# EAGLE design DataBreak (EAGLE 6.6.0)
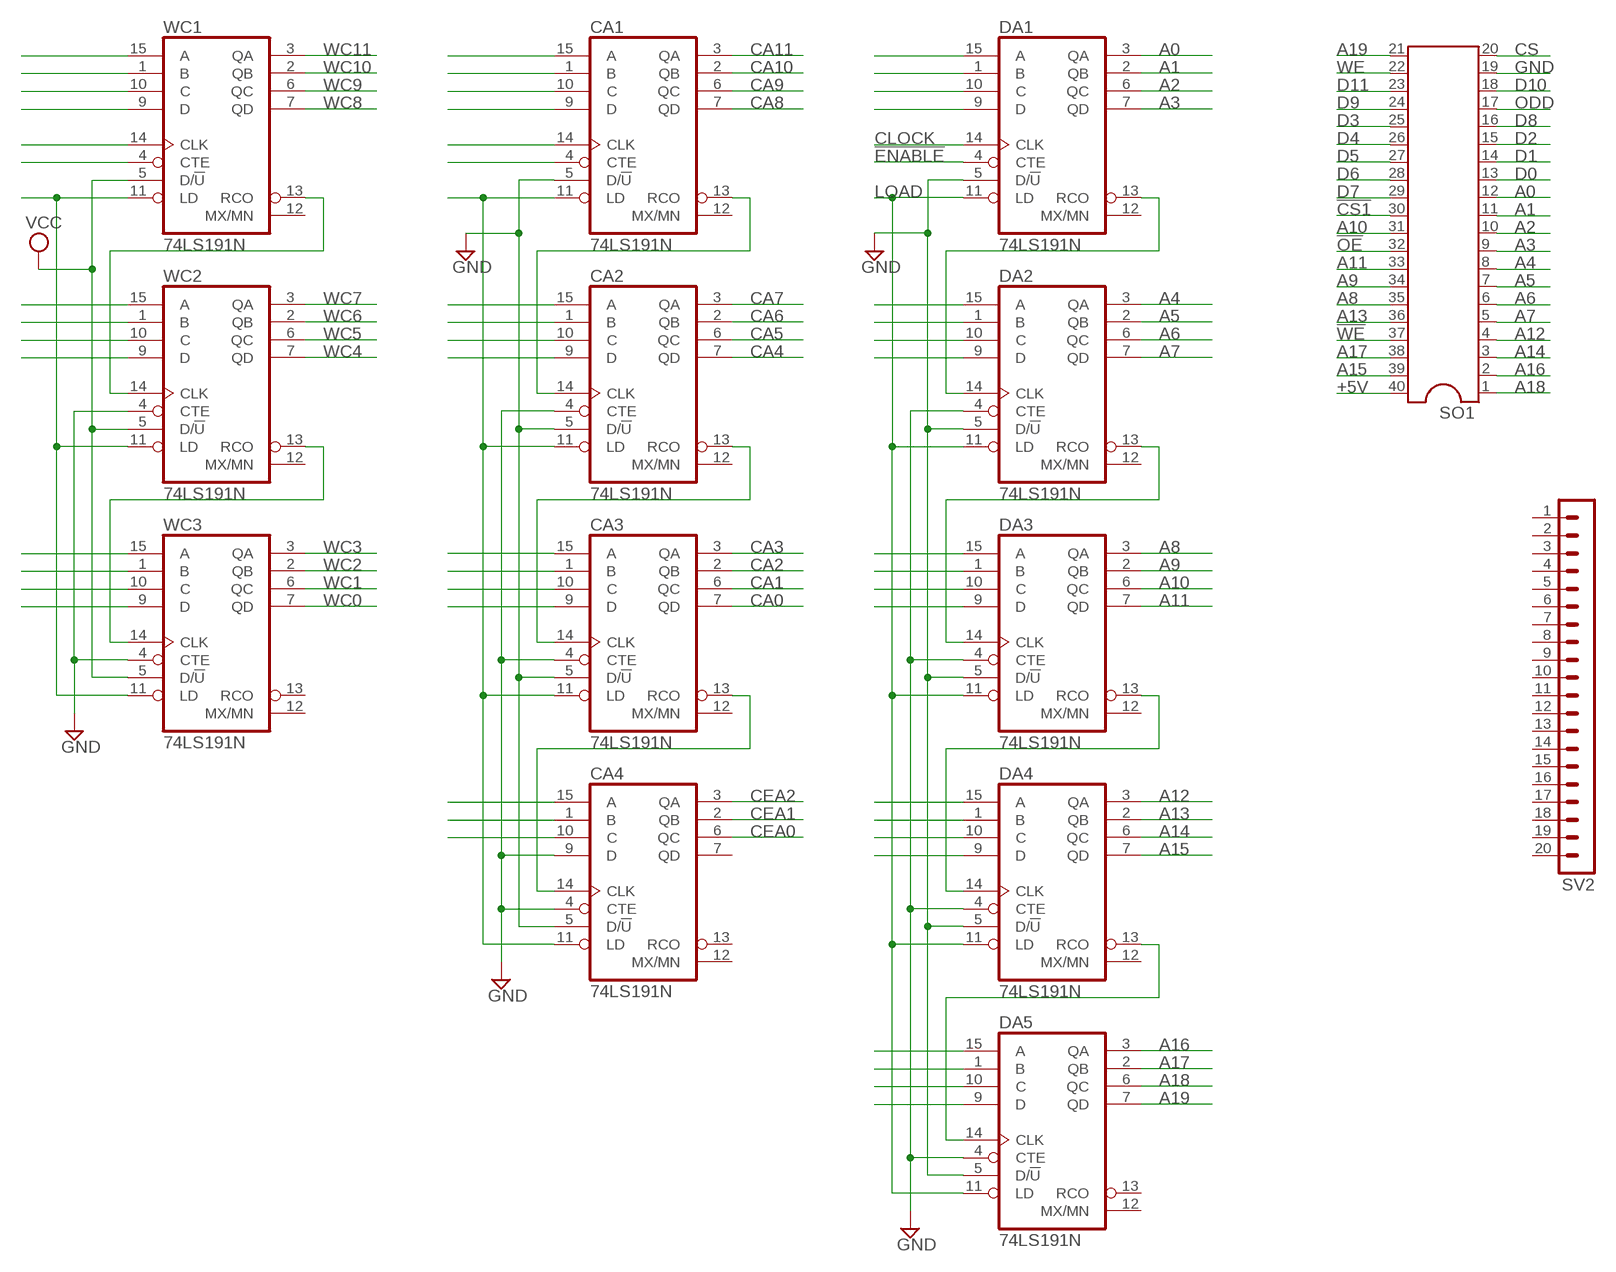
[diagram p0: schematic, sheet 1]

## Parts
CA1  74LS191N  74LS190N  [DIL16]
CA2  74LS191N  74LS190N  [DIL16]
CA3  74LS191N  74LS190N  [DIL16]
CA4  74LS191N  74LS190N  [DIL16]
DA1  74LS191N  74LS190N  [DIL16]
DA2  74LS191N  74LS190N  [DIL16]
DA3  74LS191N  74LS190N  [DIL16]
DA4  74LS191N  74LS190N  [DIL16]
DA5  74LS191N  74LS190N  [DIL16]
SO1  DIL40  [DIL40]
SV2  MA20-1L  [MA20-1L]
WC1  74LS191N  74LS190N  [DIL16]
WC2  74LS191N  74LS190N  [DIL16]
WC3  74LS191N  74LS190N  [DIL16]

## Nets
!CS1: SO1.30
!ENABLE: DA1.4(CTE)
!OE: SO1.32
!WE: SO1.37
+5V: SO1.40
A0: DA1.3(QA) SO1.12
A1: DA1.2(QB) SO1.11
A2: DA1.6(QC) SO1.10
A3: DA1.7(QD) SO1.9
A4: DA2.3(QA) SO1.8
A5: DA2.2(QB) SO1.7
A6: DA2.6(QC) SO1.6
A7: DA2.7(QD) SO1.5
A8: DA3.3(QA) SO1.35
A9: DA3.2(QB) SO1.34
A10: DA3.6(QC) SO1.31
A11: DA3.7(QD) SO1.33
A12: DA4.3(QA) SO1.4
A13: DA4.2(QB) SO1.36
A14: DA4.6(QC) SO1.3
A15: DA4.7(QD) SO1.39
A16: DA5.3(QA) SO1.2
A17: DA5.2(QB) SO1.38
A18: DA5.6(QC) SO1.1
A19: DA5.7(QD) SO1.21
CA0: CA3.7(QD)
CA1: CA3.6(QC)
CA2: CA3.2(QB)
CA3: CA3.3(QA)
CA4: CA2.7(QD)
CA5: CA2.6(QC)
CA6: CA2.2(QB)
CA7: CA2.3(QA)
CA8: CA1.7(QD)
CA9: CA1.6(QC)
CA10: CA1.2(QB)
CA11: CA1.3(QA)
CEA0: CA4.6(QC)
CEA1: CA4.2(QB)
CEA2: CA4.3(QA)
CLOCK: DA1.14(CLK)
CS: SO1.20
D0: SO1.13
D1: SO1.14
D2: SO1.15
D3: SO1.25
D4: SO1.26
D5: SO1.27
D6: SO1.28
D7: SO1.29
D8: SO1.16
D9: SO1.24
D10: SO1.18
D11: SO1.23
GND: CA1.5(D/!U) CA2.4(CTE) CA2.5(D/!U) CA3.4(CTE) CA3.5(D/!U) CA4.4(CTE) CA4.5(D/!U) CA4.9(D) DA1.5(D/!U) DA2.4(CTE) DA2.5(D/!U) DA3.4(CTE) DA3.5(D/!U) DA4.4(CTE) DA4.5(D/!U) DA5.4(CTE) DA5.5(D/!U) SO1.19 WC2.4(CTE) WC3.4(CTE)
LOAD: DA1.11(LD) DA2.11(LD) DA3.11(LD) DA4.11(LD) DA5.11(LD)
N$1: DA1.13(RCO) DA2.14(CLK)
N$2: DA1.15(A)
N$3: DA1.1(B)
N$4: DA1.10(C)
N$5: DA1.9(D)
N$6: DA2.15(A)
N$7: DA2.1(B)
N$8: DA2.10(C)
N$9: DA2.9(D)
N$10: DA2.13(RCO) DA3.14(CLK)
N$11: DA3.13(RCO) DA4.14(CLK)
N$12: DA4.13(RCO) DA5.14(CLK)
N$13: DA3.15(A)
N$14: DA3.1(B)
N$15: DA3.10(C)
N$16: DA3.9(D)
N$17: DA4.15(A)
N$18: CA1.15(A)
N$19: DA4.1(B)
N$20: DA4.9(D)
N$21: DA4.10(C)
N$22: DA5.15(A)
N$23: DA5.1(B)
N$24: DA5.10(C)
N$25: DA5.9(D)
N$26: WC1.13(RCO) WC2.14(CLK)
N$27: WC2.13(RCO) WC3.14(CLK)
N$28: CA1.13(RCO) CA2.14(CLK)
N$29: CA2.13(RCO) CA3.14(CLK)
N$30: CA3.13(RCO) CA4.14(CLK)
N$31: CA1.1(B)
N$32: CA1.14(CLK)
N$33: CA1.4(CTE)
N$34: CA1.10(C)
N$35: CA1.9(D)
N$36: CA2.1(B)
N$37: CA2.15(A)
N$38: CA2.9(D)
N$39: CA3.1(B)
N$40: CA3.10(C)
N$41: CA3.9(D)
N$42: CA4.15(A)
N$43: CA4.1(B)
N$44: CA4.10(C)
N$45: CA1.11(LD) CA2.11(LD) CA3.11(LD) CA4.11(LD)
N$46: WC1.11(LD) WC2.11(LD) WC3.11(LD)
N$47: WC1.15(A)
N$48: CA3.15(A)
N$49: CA2.10(C)
N$50: WC1.4(CTE)
N$51: WC1.14(CLK)
N$52: WC1.9(D)
N$53: WC1.1(B)
N$54: WC1.10(C)
N$55: WC2.15(A)
N$56: WC2.1(B)
N$57: WC2.10(C)
N$58: WC3.1(B)
N$59: WC3.15(A)
N$60: WC2.9(D)
N$61: WC3.10(C)
N$62: WC3.9(D)
ODD: SO1.17
VCC: WC1.5(D/!U) WC2.5(D/!U) WC3.5(D/!U)
WC0: WC3.7(QD)
WC1: WC3.6(QC)
WC2: WC3.2(QB)
WC3: WC3.3(QA)
WC4: WC2.7(QD)
WC5: WC2.6(QC)
WC6: WC2.2(QB)
WC7: WC2.3(QA)
WC8: WC1.7(QD)
WC9: WC1.6(QC)
WC10: WC1.2(QB)
WC11: WC1.3(QA)
WE: SO1.22
Unconnected: CA1.12(MX/MN) CA2.12(MX/MN) CA3.12(MX/MN) CA4.7(QD) CA4.12(MX/MN) CA4.13(RCO) DA1.12(MX/MN) DA2.12(MX/MN) DA3.12(MX/MN) DA4.12(MX/MN) DA5.12(MX/MN) DA5.13(RCO) SV2.1 SV2.2 SV2.3 SV2.4 SV2.5 SV2.6 SV2.7 SV2.8 SV2.9 SV2.10 SV2.11 SV2.12 SV2.13 SV2.14 SV2.15 SV2.16 SV2.17 SV2.18 SV2.19 SV2.20 WC1.12(MX/MN) WC2.12(MX/MN) WC3.12(MX/MN) WC3.13(RCO)

## Power pins joined to a net without a drawn wire
GND: CA1.8(GND) CA2.8(GND) CA3.8(GND) CA4.8(GND) DA1.8(GND) DA2.8(GND) DA3.8(GND) DA4.8(GND) DA5.8(GND) WC1.8(GND) WC2.8(GND) WC3.8(GND)
VCC: CA1.16(VCC) CA2.16(VCC) CA3.16(VCC) CA4.16(VCC) DA1.16(VCC) DA2.16(VCC) DA3.16(VCC) DA4.16(VCC) DA5.16(VCC) WC1.16(VCC) WC2.16(VCC) WC3.16(VCC)

## Library data of the parts
CA1-CA4 DA1-DA5 WC1-WC3 = 74xx-us:74*190: Synchronous UP/DOWN COUNTER
SO1 = ic-package:DIL40: Dual In Line
SV2 = con-lstb:MA20-1L: PIN HEADER; OC_FARNELL: unknown; OC_NEWARK: unknown

## Board
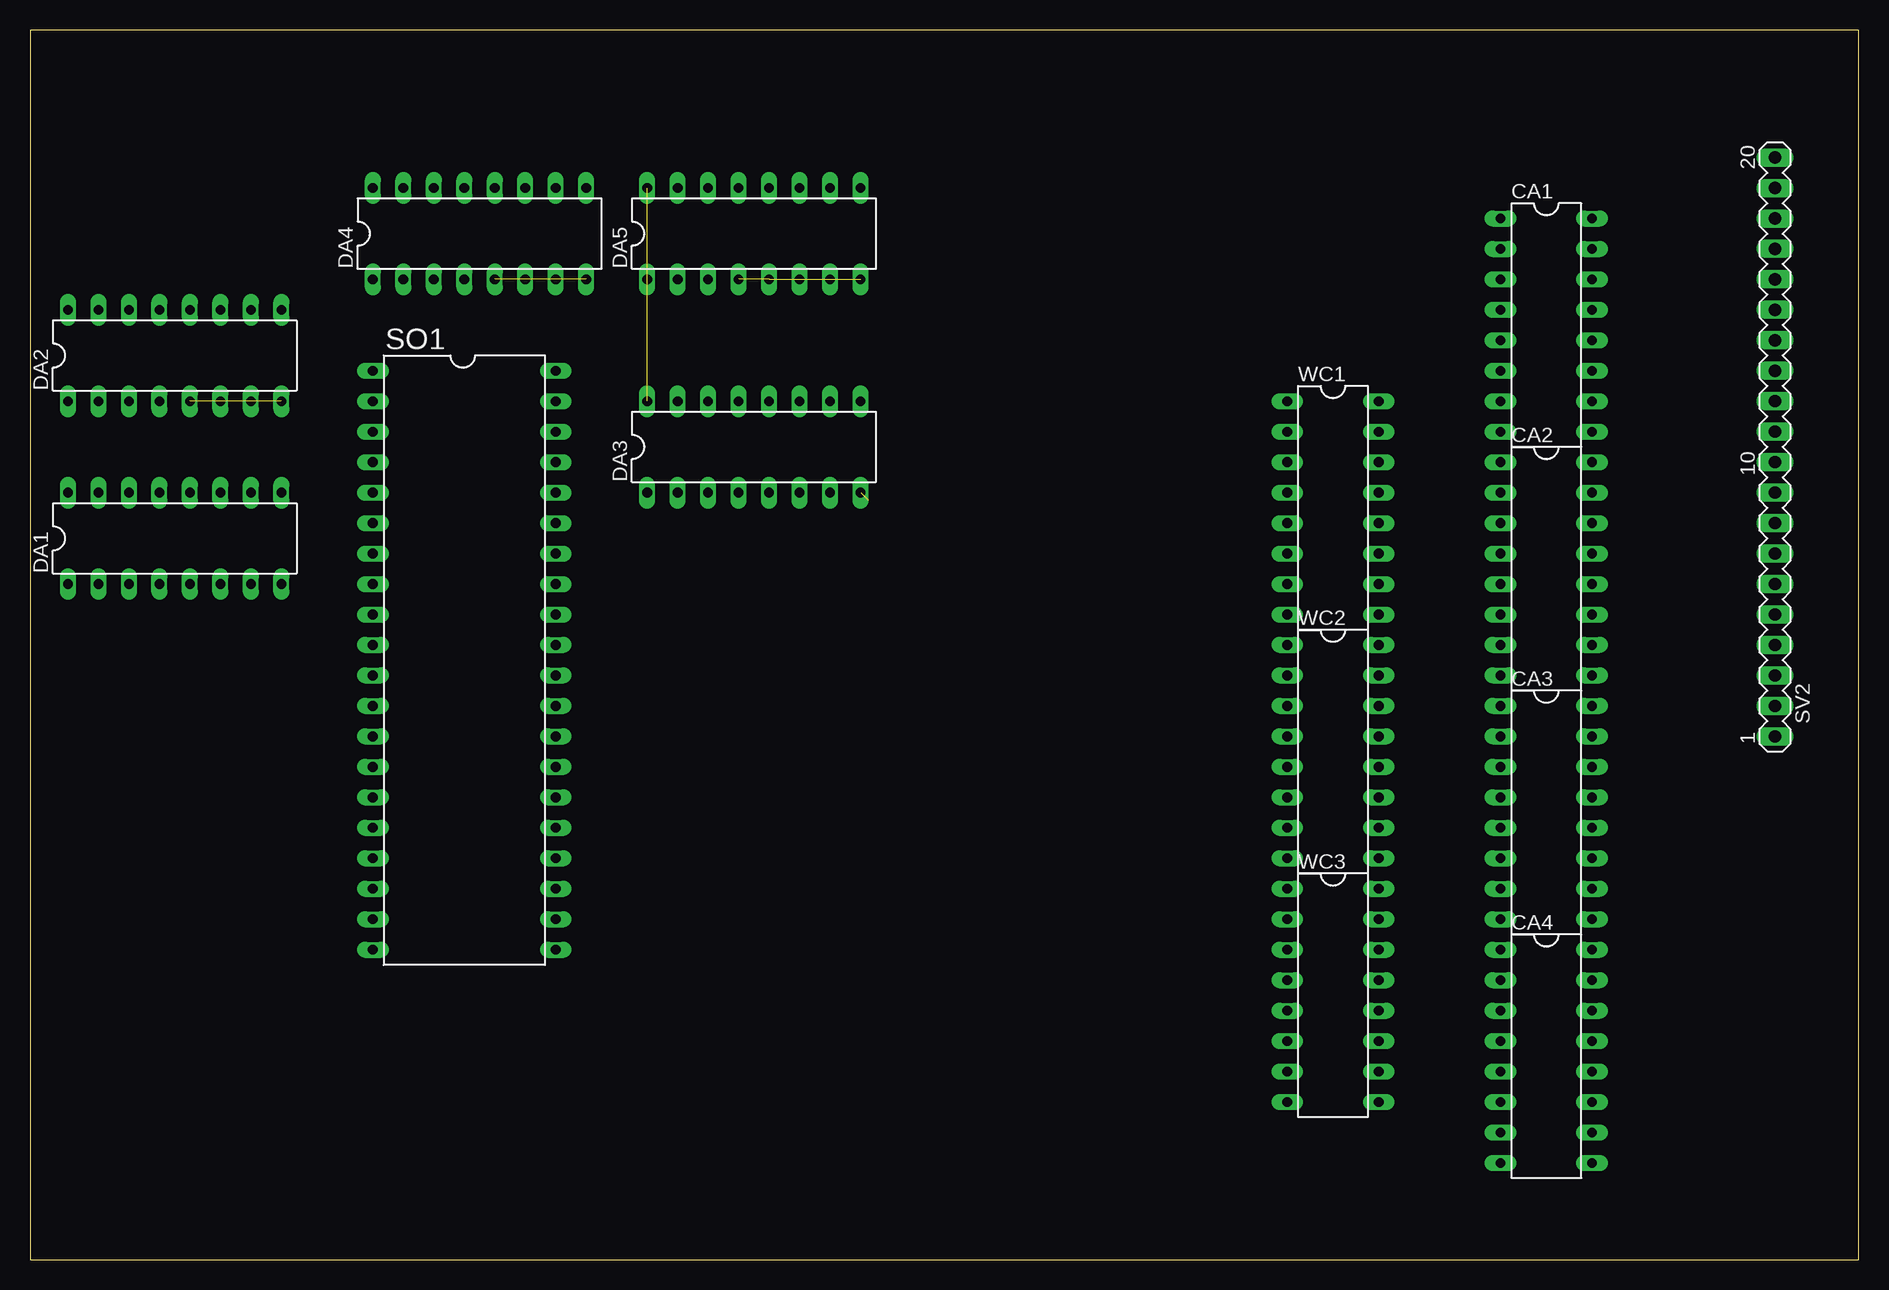
[diagram p1: board, top side]
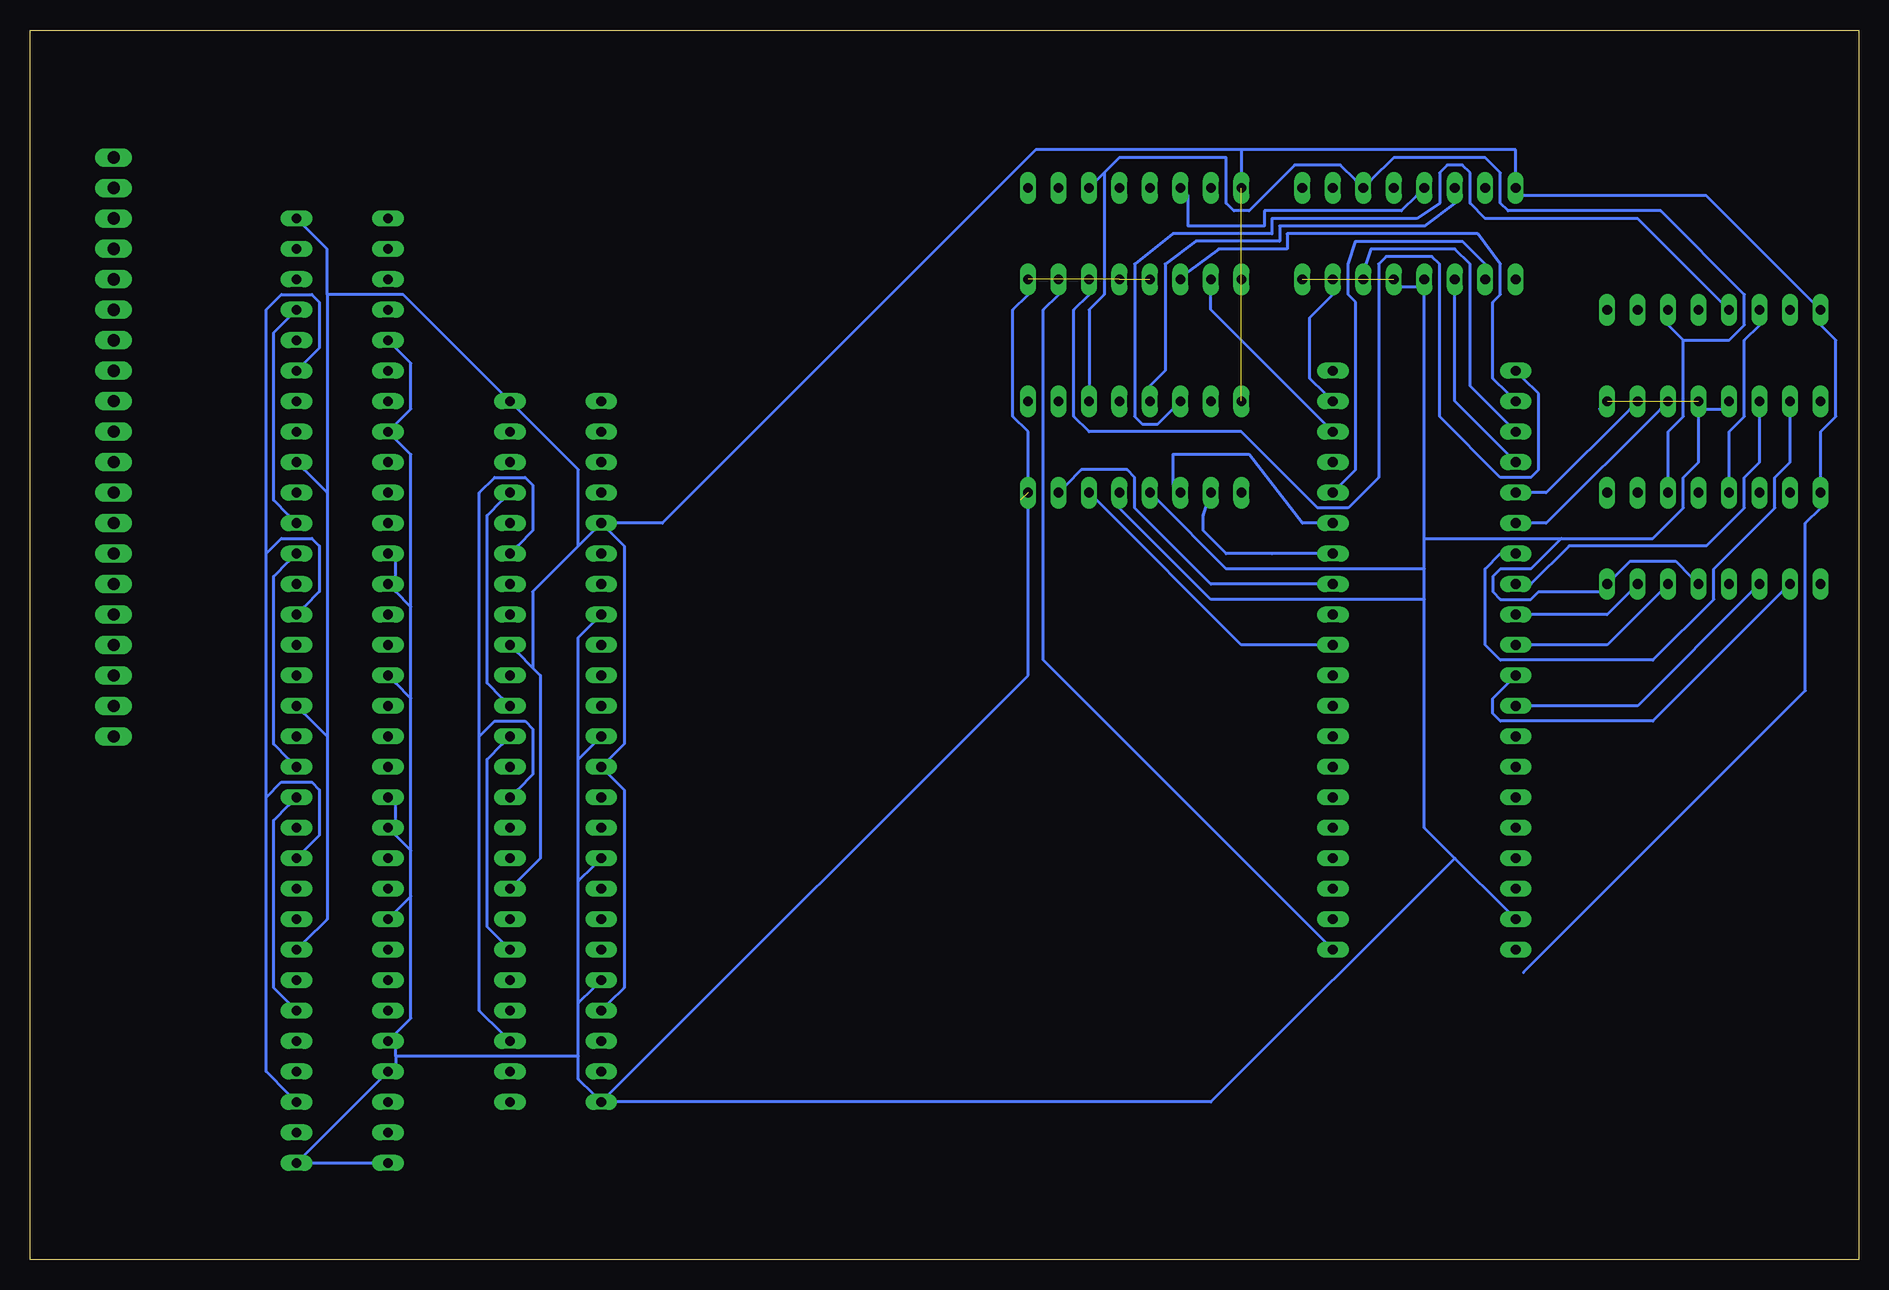
[diagram p2: board, bottom side, seen from below]

Size 152.38 x 102.54 mm. Coordinates in mm from the lower left corner, seen from the top.
Outline: 0,0 152.38,0 152.38,102.54 0,102.54 0,0
Copper layers (1*16): Top 0.035mm / dielectric 1.5mm / Bottom 0.035mm
Design rules "default": minimum track width 10mil, minimum drill 24mil, track to track 8mil, track to pad 8mil, pad to pad 8mil, via to via 8mil, smd to smd 8mil, copper to edge 40mil, drill to drill 8mil, minimum pad ring 10mil, minimum via ring 8mil, stop-mask expansion 4mil, vias tented up to drill 0mil, thermal gap 10mil

### Footprints (pad centres in the part's own frame; a part is rotated, then mirrored left to right if it is on the bottom)
DIL16 = drill 0.813 long: 1 -8.89,-3.81; 2 -6.35,-3.81; 3 -3.81,-3.81; 4 -1.27,-3.81; 5 1.27,-3.81; 6 3.81,-3.81; 7 6.35,-3.81; 8 8.89,-3.81; 9 8.89,3.81; 10 6.35,3.81; 11 3.81,3.81; 12 1.27,3.81; 13 -1.27,3.81; 14 -3.81,3.81; 15 -6.35,3.81; 16 -8.89,3.81
DIL40 = drill 0.813 long: 1 -24.13,-7.62; 2 -21.59,-7.62; 3 -19.05,-7.62; 4 -16.51,-7.62; 5 -13.97,-7.62; 6 -11.43,-7.62; 7 -8.89,-7.62; 8 -6.35,-7.62; 9 -3.81,-7.62; 10 -1.27,-7.62; 11 1.27,-7.62; 12 3.81,-7.62; 13 6.35,-7.62; 14 8.89,-7.62; 15 11.43,-7.62; 16 13.97,-7.62; 17 16.51,-7.62; 18 19.05,-7.62; 19 21.59,-7.62; 20 24.13,-7.62; 21 24.13,7.62; 22 21.59,7.62; 23 19.05,7.62; 24 16.51,7.62; 25 13.97,7.62; 26 11.43,7.62; 27 8.89,7.62; 28 6.35,7.62; 29 3.81,7.62; 30 1.27,7.62; 31 -1.27,7.62; 32 -3.81,7.62; 33 -6.35,7.62; 34 -8.89,7.62; 35 -11.43,7.62; 36 -13.97,7.62; 37 -16.51,7.62; 38 -19.05,7.62; 39 -21.59,7.62; 40 -24.13,7.62
MA20-1L = drill 1.016 long: 1 24.13,0; 2 21.59,0; 3 19.05,0; 4 16.51,0; 5 13.97,0; 6 11.43,0; 7 8.89,0; 8 6.35,0; 9 3.81,0; 10 1.27,0; 11 -1.27,0; 12 -3.81,0; 13 -6.35,0; 14 -8.89,0; 15 -11.43,0; 16 -13.97,0; 17 -16.51,0; 18 -19.05,0; 19 -21.59,0; 20 -24.13,0

### Placement (x,y rotation side)
CA1  126.36,77.94 270 top
CA2  126.36,57.62 270 top
CA3  126.36,37.3 270 top
CA4  126.36,16.98 270 top
DA1  12.06,60.16 0 top
DA2  12.06,75.4 0 top
DA3  60.32,67.78 0 top
DA4  37.46,85.56 0 top
DA5  60.32,85.56 0 top
SO1  36.19,50 270 top
SV2  145.41,67.78 270 top
WC1  108.58,62.7 270 top
WC2  108.58,42.38 270 top
WC3  108.58,22.06 270 top

### Tracks (layer width: path | path; a pad name or v marks a point on that pad's centre or on a via)
A0
  Bottom 0.254: DA1.3 8.89,55.71 18.41,46.19 27.3,46.19 SO1.12
A1
  Bottom 0.254: DA1.2 6.34,55.71 17.14,44.92 29.84,44.92 30.47,45.55 30.47,46.82 29.2,48.09 SO1.11
A2
  Bottom 0.254: DA1.6 16.5,55.71 20.95,51.27 27.3,51.27 SO1.10
A3
  Bottom 0.254: DA1.7 19.04,55.71 20.95,53.81 27.3,53.81 SO1.9
A4
  Bottom 0.254: DA2.3 8.25,70.32 8.25,66.51 9.52,65.24 9.52,62.7 12.7,59.52 24.12,59.52 27.3,56.35 SO1.8
A5
  Bottom 0.254: DA2.2 5.71,70.32 5.71,66.51 6.98,65.24 6.98,62.7 12.06,57.62 12.06,55.08 17.14,50 29.84,50 31.11,51.27 31.11,57.62 29.84,58.89 SO1.7
A6
  Bottom 0.254: DA2.6 16.5,70.95 26.03,61.43 27.3,61.43 SO1.6
A7
  Bottom 0.254: DA2.7 19.04,70.95 26.03,63.97 27.3,63.97 SO1.5
A8
  Bottom 0.254: SO1.35 45.08,61.43 46.35,61.43 50.8,67.14 57.15,67.14 57.15,64.61 DA3.3
A9
  Bottom 0.254: SO1.34 45.08,58.89 48.89,58.89 52.7,58.89 54.61,60.8 54.61,62.06 DA3.2
A10
  Bottom 0.254: SO1.31 45.08,51.27 51.43,51.27 63.5,63.34 DA3.6
A11
  Bottom 0.254: SO1.33 45.08,56.35 53.97,56.35 60.32,62.7 60.32,65.24 60.96,65.88 64.77,65.88 66.03,64.61 DA3.7
A12
  Bottom 0.254: SO1.4 29.2,67.14 33.65,71.59 33.65,80.48 DA4.3
A13
  Bottom 0.254: SO1.36 43.18,64.61 41.91,65.88 41.91,79.84 42.54,80.48 42.54,83.02 41.91,84.92 33.02,84.92 31.11,83.02 DA4.2
A14
  Bottom 0.254: SO1.3 29.2,69.69 32.38,72.86 32.38,83.02 33.65,84.29 40.64,84.29 41.27,82.39 DA4.6
A15
  Bottom 0.254: SO1.39 44.45,72.22 45.72,73.5 45.72,78.58 43.81,80.48 DA4.7
A16
  Bottom 0.254: SO1.2 29.2,72.22 30.47,73.5 30.47,79.84 29.84,80.48 29.84,83.02 31.74,85.56 47.62,85.56 47.62,84.29 53.34,84.29 55.88,82.39 DA5.3
A17
  Bottom 0.254: SO1.38 44.45,69.69 53.97,79.21 53.97,80.48 DA5.2
A18
  Bottom 0.254: SO1.1 27.93,73.5 26.66,72.22 26.66,65.88 27.3,65.24 29.84,65.24 34.92,70.32 34.92,83.02 35.55,83.66 39.37,83.66 40,83.02 40,65.24 42.54,62.7 45.08,62.7 51.43,69.05 64.13,69.05 65.4,70.32 65.4,79.21 64.13,80.48 DA5.6
A19
  Bottom 0.254: SO1.21 44.45,26.5 67.94,50 67.94,79.21 66.67,80.48 DA5.7
GND  (5 unrouted)
  Bottom 0.254: DA2.4 11.43,70.95 12.7,70.95 DA2.5 13.33,70.32 13.33,66.51 14.6,65.24 14.6,62.7 17.14,60.16 24.76,60.16 | DA5.8 69.21,80.48 70.48,79.21 70.48,70.32 69.21,69.05 69.21,65.24 DA3.8 69.21,62.7 69.21,48.73 104.13,13.81 WC3.8 | DA4.5 38.1,81.11 36.83,81.11 DA4.4 36.19,80.48 36.19,60.16 | DA1.5 13.97,56.98 15.24,58.25 19.04,58.25 20.31,56.98 DA1.8 21.58,55.71 26.66,55.71 27.3,55.08 29.84,55.08 30.47,55.71 30.47,56.98 29.84,57.62 27.3,57.62 24.76,60.16 | 21.58,70.95 DA2.8 | 106.67,16.98 106.67,21.42 | 106.67,16.98 106.67,15.08 105.41,13.81 WC3.8 | 106.67,21.42 105.41,22.7 WC3.4 | 106.67,31.58 105.41,32.85 WC2.8 | 106.67,21.42 106.67,31.58 | 106.67,41.74 105.41,43.02 WC2.4 | 106.67,31.58 106.67,41.74 | 106.67,41.74 106.67,51.91 105.41,53.17 WC1.8 | 121.91,16.98 121.91,17.61 CA4.4 121.91,18.88 120.64,20.15 120.64,30.31 | 121.91,16.98 121.91,16.34 CA4.5 123.19,15.08 129.53,8.73 CA4.9 128.9,8.09 123.82,8.09 CA4.8 | CA1.5 121.91,76.03 120.64,74.77 120.64,70.95 121.91,69.69 CA1.8 121.91,68.41 120.64,67.14 120.64,54.45 | CA2.4 121.91,58.25 121.91,56.98 CA2.5 121.91,55.71 120.64,54.45 | 120.64,30.31 121.91,29.04 CA3.8 | 120.64,30.31 120.64,34.12 | 120.64,34.12 121.91,35.39 CA3.5 121.91,36.66 121.91,37.94 CA3.4 | 120.64,46.82 121.91,48.09 CA2.8 | 120.64,34.12 120.64,46.82 | 120.64,46.82 120.64,54.45 | 106.67,16.98 121.91,16.98 | 33.65,33.49 36.19,36.03 36.19,55.08 | 33.65,33.49 29.2,29.04 SO1.19 | 36.19,57.62 36.19,60.16 | 36.19,55.08 36.19,57.62 | 36.19,57.62 52.7,57.62 58.41,63.34 DA3.4 | 36.19,55.08 53.97,55.08 61.59,62.7 DA3.5 | 36.19,60.16 24.76,60.16 | 33.65,33.49 53.97,13.17 103.5,13.17 WC3.8
LOAD
  Bottom 0.254: 14.6,76.67 14.6,70.32 15.87,69.05 15.87,65.24 DA1.11 | 14.6,76.67 15.87,77.94 DA2.11 | 62.86,90.64 63.5,90 DA5.11 | 62.86,90.64 62.23,91.28 61.59,91.91 52.7,91.91 52.7,88.1 52.07,87.47 50.8,87.47 46.98,91.28 43.18,91.28 41.91,90 DA4.11 40.64,90 38.73,91.91 31.11,91.91 29.84,90.64 29.84,88.1 29.2,87.47 16.5,87.47 9.52,80.48 9.52,77.94 10.79,76.67 14.6,76.67 | 62.86,90.64 62.86,80.48 64.13,79.21 64.13,72.86 DA3.11
N$1
  Bottom 0.254: DA1.13 10.79,65.24 10.79,69.05 9.52,70.32 9.52,76.67 8.25,77.94 DA2.14
N$10
  Bottom 0.254: 11.43,79.84 DA2.13 11.43,79.84 | DA3.14 57.15,70.95 58.41,69.69 59.69,69.69 60.32,70.32 60.32,83.02 57.15,85.56 48.89,85.56 48.89,86.83 36.83,86.83 34.92,88.1 34.92,90.64 34.29,91.28 33.02,91.28 32.38,90.64 32.38,88.1 31.11,86.83 18.41,86.83 11.43,79.84
N$11
  Bottom 0.254: DA4.14 33.65,88.1 36.19,86.19 48.26,86.19 48.26,84.92 55.24,84.92 57.78,83.02 57.78,74.13 59.05,72.86 DA3.13
N$12
  Bottom 0.254: DA4.13 36.83,88.73 38.1,87.47 49.53,87.47 49.53,86.19 55.88,86.19 55.88,88.73 DA5.14
N$26
  Bottom 0.254: WC2.14 113.02,46.82 114.3,48.09 114.3,62.06 113.02,63.34 WC1.13
N$27
  Bottom 0.254: WC3.14 113.02,26.5 114.3,27.77 114.3,41.74 113.02,43.02 WC2.13
N$28
  Bottom 0.254: CA2.14 130.81,62.06 132.07,63.34 132.07,77.3 130.81,78.58 CA1.13
N$29
  Bottom 0.254: CA3.14 130.81,41.74 132.07,43.02 132.07,56.98 130.81,58.25 CA2.13
N$30
  Bottom 0.254: CA4.14 130.81,21.42 132.07,22.7 132.07,36.66 130.81,37.94 CA3.13
N$45
  Bottom 0.254: 132.71,38.57 132.71,15.71 130.81,13.81 CA4.11 | 132.71,38.57 131.44,39.84 128.9,39.84 128.27,39.2 128.27,35.39 129.53,34.12 CA3.11 | 132.71,58.89 131.44,60.16 128.9,60.16 128.27,59.52 128.27,55.71 129.53,54.45 CA2.11 | 132.71,38.57 132.71,58.89 | 132.71,58.89 132.71,79.21 131.44,80.48 128.9,80.48 128.27,79.84 128.27,76.03 129.53,74.77 CA1.11
N$46
  Bottom 0.254: 114.93,43.65 114.93,20.79 113.02,18.88 WC3.11 | 114.93,43.65 113.66,44.92 111.12,44.92 110.48,44.28 110.48,40.48 111.75,39.2 WC2.11 | 114.93,43.65 114.93,63.97 113.66,65.24 111.12,65.24 110.48,64.61 110.48,60.8 111.75,59.52 WC1.11
VCC  (1 unrouted)
  Bottom 0.254: DA2.16 3.17,77.94 1.9,76.67 1.9,70.32 3.17,69.05 3.17,65.24 DA1.16 3.17,62.7 4.44,61.43 4.44,47.46 27.93,23.96 | 51.43,92.55 28.57,92.55 28.57,90.64 DA4.16 27.93,88.73 12.7,88.73 3.8,79.84 | 51.43,92.55 68.57,92.55 99.69,61.43 103.5,61.43 WC1.5 | DA2.16 3.8,79.84 | 51.43,92.55 51.43,90.64 DA5.16 | DA2.16 3.8,79.84 | WC3.5 104.13,21.42 102.86,22.7 102.86,39.2 104.13,40.48 WC2.5 104.13,41.74 102.86,43.02 102.86,59.52 104.13,60.8 WC1.5 | 110.48,49.37 111.75,50.63 WC2.16 | 110.48,49.37 109.85,48.73 109.85,33.49 111.75,31.58 WC3.16 | 106.67,59.52 110.48,55.71 110.48,49.37 | 106.67,59.52 105.41,60.8 WC1.5 | 106.67,59.52 106.67,65.88 111.75,70.95 WC1.16 113.02,72.22 121.28,80.48 127.63,80.48 | 127.63,43.65 127.63,28.41 129.53,26.5 CA4.16 | 127.63,43.65 129.53,45.55 CA3.16 | 127.63,63.97 129.53,65.88 CA2.16 | 127.63,63.97 127.63,43.65 | 127.63,80.48 127.63,63.97 | 127.63,80.48 127.63,84.29 129.53,86.19 CA1.16